# Altium schematic sheet LEDs.SchDoc
size A4
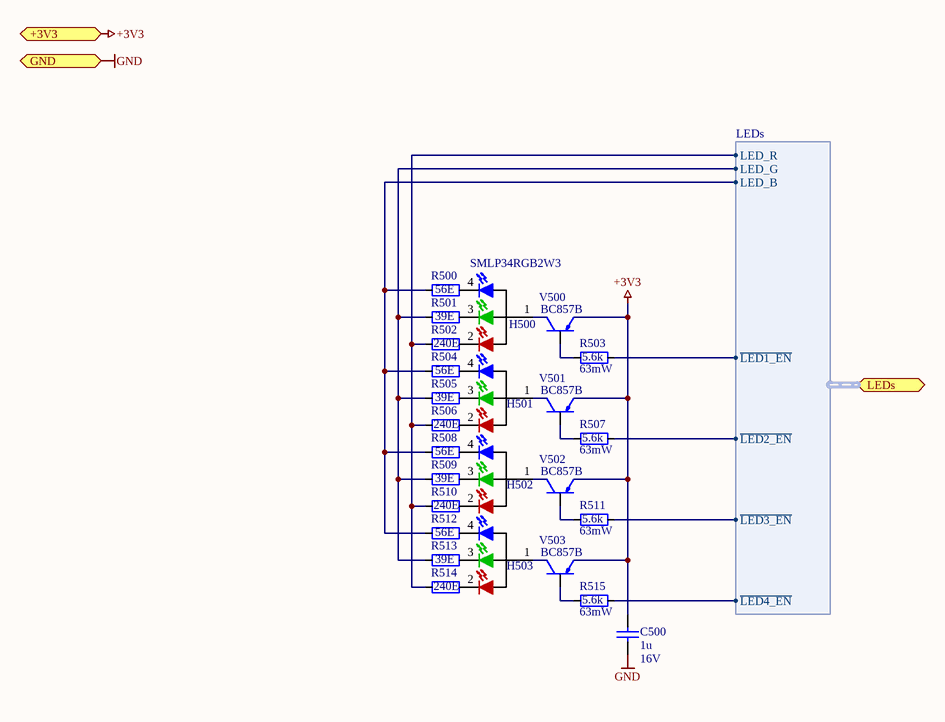
[diagram p0: LEDs.SchDoc]

## Parts
C500  value 1u  Value2: 16V  [SMD_CAP_0603]  (hidden comment: C_SMD_CER_1U_16V_10%_X7R_0603)
H500  Type: SMLP34RGB2W3  [SMD_LED_0404]  (hidden comment: H_SMD_LED_RGB_DIFFUSED_5MA_0404)
H501  H_SMD_LED_RGB_DIFFUSED_5MA_0404  [SMD_LED_0404]  (value not drawn)
H502  H_SMD_LED_RGB_DIFFUSED_5MA_0404  [SMD_LED_0404]  (value not drawn)
H503  H_SMD_LED_RGB_DIFFUSED_5MA_0404  [SMD_LED_0404]  (value not drawn)
R500  value 56E  [SMD_RES_0402]  (hidden comment: R_SMD_THINFILM_56E_0W063_0%5_50PPM_0402)
R501  value 39E  [SMD_RES_0402]  (hidden comment: R_SMD_THINFILM_39E_0W063_0%5_50PPM_0402)
R502  value 240E  [SMD_RES_0402]  (hidden comment: R_SMD_THINFILM_240E_0W063_0%5_25PPM_0402)
R503  value 5.6k  Value2: 63mW  [SMD_RES_0402]  (hidden comment: R_SMD_THINFILM_5K6_0W063_0%5_25PPM_0402)
R504  value 56E  [SMD_RES_0402]  (hidden comment: R_SMD_THINFILM_56E_0W063_0%5_50PPM_0402)
R505  value 39E  [SMD_RES_0402]  (hidden comment: R_SMD_THINFILM_39E_0W063_0%5_50PPM_0402)
R506  value 240E  [SMD_RES_0402]  (hidden comment: R_SMD_THINFILM_240E_0W063_0%5_25PPM_0402)
R507  value 5.6k  Value2: 63mW  [SMD_RES_0402]  (hidden comment: R_SMD_THINFILM_5K6_0W063_0%5_25PPM_0402)
R508  value 56E  [SMD_RES_0402]  (hidden comment: R_SMD_THINFILM_56E_0W063_0%5_50PPM_0402)
R509  value 39E  [SMD_RES_0402]  (hidden comment: R_SMD_THINFILM_39E_0W063_0%5_50PPM_0402)
R510  value 240E  [SMD_RES_0402]  (hidden comment: R_SMD_THINFILM_240E_0W063_0%5_25PPM_0402)
R511  value 5.6k  Value2: 63mW  [SMD_RES_0402]  (hidden comment: R_SMD_THINFILM_5K6_0W063_0%5_25PPM_0402)
R512  value 56E  [SMD_RES_0402]  (hidden comment: R_SMD_THINFILM_56E_0W063_0%5_50PPM_0402)
R513  value 39E  [SMD_RES_0402]  (hidden comment: R_SMD_THINFILM_39E_0W063_0%5_50PPM_0402)
R514  value 240E  [SMD_RES_0402]  (hidden comment: R_SMD_THINFILM_240E_0W063_0%5_25PPM_0402)
R515  value 5.6k  Value2: 63mW  [SMD_RES_0402]  (hidden comment: R_SMD_THINFILM_5K6_0W063_0%5_25PPM_0402)
V500  Type: BC857B  [SMD_SOT_23_3]  (hidden comment: V_SMD_TRANS_PNP_BC857B_45V_0A1_SOT-23-3)
V501  Type: BC857B  [SMD_SOT_23_3]  (hidden comment: V_SMD_TRANS_PNP_BC857B_45V_0A1_SOT-23-3)
V502  Type: BC857B  [SMD_SOT_23_3]  (hidden comment: V_SMD_TRANS_PNP_BC857B_45V_0A1_SOT-23-3)
V503  Type: BC857B  [SMD_SOT_23_3]  (hidden comment: V_SMD_TRANS_PNP_BC857B_45V_0A1_SOT-23-3)

## Ports
+3V3, GND, LEDs (harness LEDs)

## Harnesses
LEDs: ~{LED1_EN}, ~{LED2_EN}, ~{LED3_EN}, ~{LED4_EN}, LED_B, LED_G, LED_R

## Nets
+3V3: C500.2 V500.2(E) V501.2(E) V502.2(E) V503.2(E) ; port +3V3
GND: C500.1 ; port GND
NetH500_1: H500.1 V500.3(C)
NetH500_2: H500.2 R502.2
NetH500_3: H500.3 R501.2
NetH500_4: H500.4 R500.2
NetH501_1: H501.1 V501.3(C)
NetH501_2: H501.2 R506.2
NetH501_3: H501.3 R505.2
NetH501_4: H501.4 R504.2
NetH502_1: H502.1 V502.3(C)
NetH502_2: H502.2 R510.2
NetH502_3: H502.3 R509.2
NetH502_4: H502.4 R508.2
NetH503_1: H503.1 V503.3(C)
NetH503_2: H503.2 R514.2
NetH503_3: H503.3 R513.2
NetH503_4: H503.4 R512.2
NetR500_1: R500.1 R504.1 R508.1 R512.1 ; port LEDs.LED_B
NetR501_1: R501.1 R505.1 R509.1 R513.1 ; port LEDs.LED_G
NetR502_1: R502.1 R506.1 R510.1 R514.1 ; port LEDs.LED_R
NetR503_1: R503.1 V500.1(B)
NetR503_2: R503.2 ; port LEDs.~{LED1_EN}
NetR507_1: R507.1 V501.1(B)
NetR507_2: R507.2 ; port LEDs.~{LED2_EN}
NetR511_1: R511.1 V502.1(B)
NetR511_2: R511.2 ; port LEDs.~{LED3_EN}
NetR515_1: R515.1 V503.1(B)
NetR515_2: R515.2 ; port LEDs.~{LED4_EN}

## Notes on the sheet
- Title
- Size:
- Date:
- A4
- Number:
- Time:
- Revision:
- Sheet
- of
- File:

## Library data of the parts
C500 = C_SMD_CER_1U_16V_10%_X7R_0603: 1µF ±10% 16V Ceramic Capacitor X7R 0603 (1608 Metric); Supplier - Digikey: 1276-1019-1-ND
H500-H503 = H_SMD_LED_RGB_DIFFUSED_5MA_0404: Red, Green, Blue (RGB) 624nm Red, 527nm Green, 470nm Blue LED Indication - Discrete 2.1V Red, 3.1V Green, 3V Blue 0404 (1010 Metric); Supplier - Digikey: SMLP34RGB2W3CT-ND
R500 R504 R508 R512 = R_SMD_THINFILM_56E_0W063_0%5_50PPM_0402: 56 Ohms ±0.5% 0.063W, 1/16W Chip Resistor 0402 (1005 Metric) Thin Film; Supplier - Digikey: 311-56UCT-ND
R501 R505 R509 R513 = R_SMD_THINFILM_39E_0W063_0%5_50PPM_0402: 39 Ohms ±0.5% 0.063W, 1/16W Chip Resistor 0402 (1005 Metric) Thin Film; Supplier - Digikey: 311-39UCT-ND
R502 R506 R510 R514 = R_SMD_THINFILM_240E_0W063_0%5_25PPM_0402: 240 Ohms ±0.5% 0.063W, 1/16W Chip Resistor 0402 (1005 Metric) Automotive AEC-Q200 Thin Film; Supplier - Digikey: P240DECT-ND
R503 R507 R511 R515 = R_SMD_THINFILM_5K6_0W063_0%5_25PPM_0402: 5.6 kOhms ±0.5% 0.063W, 1/16W Chip Resistor 0402 (1005 Metric) Automotive AEC-Q200 Thin Film; Supplier - Digikey: RNCF0402DTE5K60CT-ND
V500-V503 = V_SMD_TRANS_PNP_BC857B_45V_0A1_SOT-23-3: SMD PNP Transistor BC857B 100mA 45V; Supplier - Digikey: BC857BLT3GOSCT-ND